# EAGLE design clocker-12b (EAGLE 7.3.0)

## Sheet 1 of 2
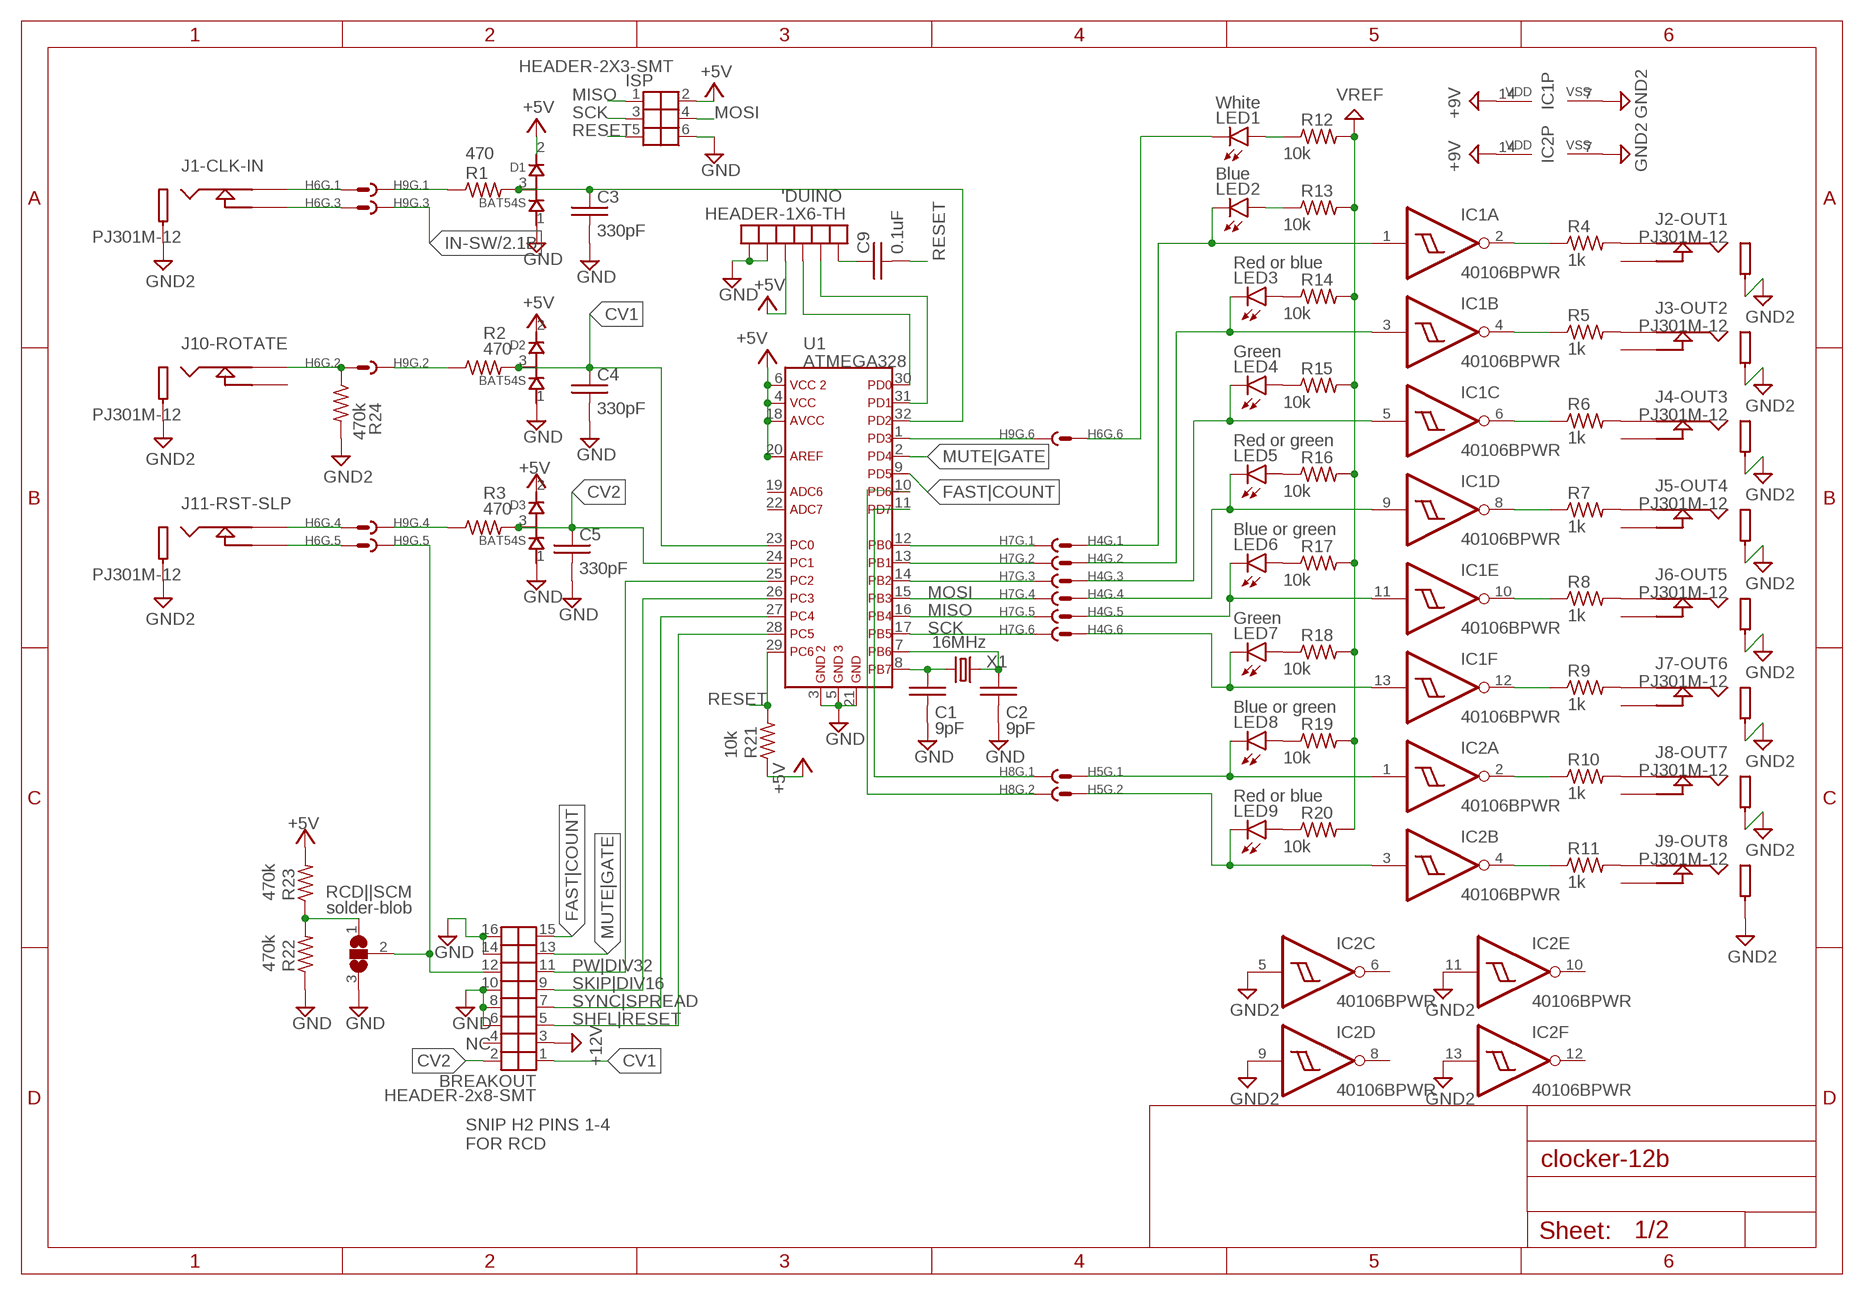
[diagram p0: schematic, sheet 1]

### Parts
'DUINO  HEADER-1X6-TH  HEADER-1X6  [HEADER-1X6-TH]
BREAKOUT  HEADER-2x8-SMT  HEADER-2X8BARE  [HEADER-2X8-SMT]
C1  9pF  CB  [C0603]
C2  9pF  CB  [C0603]
C3  330pF  CB  [C0603]
C4  330pF  CB  [C0603]
C5  330pF  CB  [C0603]
C9  0.1uF  CB  [C0603]
D1  BAT54S  DIODE-DUAL  [SOT23]
D2  BAT54S  DIODE-DUAL  [SOT23]
D3  BAT54S  DIODE-DUAL  [SOT23]
H4  HEADER-2X3-B2B-MALESMT  [HEADER-2X3-SMT]
H5  HEADER-2X3-B2B-MALESMT  [HEADER-2X3-SMT]
H6  HEADER-2X3-B2B-MALESMT  [HEADER-2X3-SMT]
H7  HEADER-2X3-B2B-FEMALETH-BOT  [HEADER-2X3-TH-BOTTOM]
H8  HEADER-2X3-B2B-FEMALETH-BOT  [HEADER-2X3-TH-BOTTOM]
H9  HEADER-2X3-B2B-FEMALETH-BOT  [HEADER-2X3-TH-BOTTOM]
IC1  40106BPWR  [TSSOP14]
IC2  40106BPWR  [TSSOP14]
ISP  HEADER-2X3-SMT  HEADER-2X3  [HEADER-2X3-SMT]
J1-CLK-IN  PJ301M-12  JACK-MONO-SWM  [PJ301M-12]
J2-OUT1  PJ301M-12  JACK-MONO-SWM  [PJ301M-12]
J3-OUT2  PJ301M-12  JACK-MONO-SWM  [PJ301M-12]
J4-OUT3  PJ301M-12  JACK-MONO-SWM  [PJ301M-12]
J5-OUT4  PJ301M-12  JACK-MONO-SWM  [PJ301M-12]
J6-OUT5  PJ301M-12  JACK-MONO-SWM  [PJ301M-12]
J7-OUT6  PJ301M-12  JACK-MONO-SWM  [PJ301M-12]
J8-OUT7  PJ301M-12  JACK-MONO-SWM  [PJ301M-12]
J9-OUT8  PJ301M-12  JACK-MONO-SWM  [PJ301M-12]
J10-ROTATE  PJ301M-12  JACK-MONO-SWM  [PJ301M-12]
J11-RST-SLP  PJ301M-12  JACK-MONO-SWM  [PJ301M-12]
LED1  White  LED  [LED-T1]
LED2  Blue  LED  [LED-T1]
LED3  Red or blue  LED  [LED-T1]
LED4  Green  LED  [LED-T1]
LED5  Red or green  LED  [LED-T1]
LED6  Blue or green  LED  [LED-T1]
LED7  Green  LED  [LED-T1]
LED8  Blue or green  LED  [LED-T1]
LED9  Red or blue  LED  [LED-T1]
R1  470  RB  [R0603]
R2  470  RB  [R0603]
R3  470  RB  [R0603]
R4  1k  RB  [R0603]
R5  1k  RB  [R0603]
R6  1k  RB  [R0603]
R7  1k  RB  [R0603]
R8  1k  RB  [R0603]
R9  1k  RB  [R0603]
R10  1k  RB  [R0603]
R11  1k  RB  [R0603]
R12  10k  RB  [R0603]
R13  10k  RB  [R0603]
R14  10k  RB  [R0603]
R15  10k  RB  [R0603]
R16  10k  RB  [R0603]
R17  10k  RB  [R0603]
R18  10k  RB  [R0603]
R19  10k  RB  [R0603]
R20  10k  RB  [R0603]
R21  10k  RB  [R0603]
R22  470k  RB  [R0603]
R23  470k  RB  [R0603]
R24  470k  RB  [R0603]
RCD||SCM  solder-blob  SJ2W  [SJ_2]
U1  ATMEGA328  ATMEGA168  [TQFP-32]
X1  16MHz  CRYSTALE  [FA-238]

### Nets
+5V: 'DUINO.P$3 D1.2(CATHODE) D2.2(CATHODE) D3.2(CATHODE) ISP.2 R21.1 R23.2 U1.4 U1.6 U1.18 U1.20 ; also sheet 2
+9V: IC1.14(P:VDD) IC2.14(P:VDD) ; also sheet 2
+12V: BREAKOUT.3 ; also sheet 2
+VREF: R12.2 R13.2 R14.2 R15.2 R16.2 R17.2 R18.2 R19.2 R20.2 ; supply symbol labelled VREF ; also sheet 2
AGND: IC1.7(P:VSS) IC2.5(C:I) IC2.7(P:VSS) IC2.9(D:I) IC2.11(E:I) IC2.13(F:I) J1-CLK-IN.2(SLEEVE) J2-OUT1.2(SLEEVE) J3-OUT2.2(SLEEVE) J4-OUT3.2(SLEEVE) J5-OUT4.2(SLEEVE) J6-OUT5.2(SLEEVE) J7-OUT6.2(SLEEVE) J8-OUT7.2(SLEEVE) J9-OUT8.2(SLEEVE) J10-ROTATE.2(SLEEVE) J11-RST-SLP.2(SLEEVE) R24.2 ; supply symbol labelled GND2 ; also sheet 2
CV1: BREAKOUT.1 C4.1 D2.3(COMMON) R2.2 U1.23
CV2: BREAKOUT.2 C5.1 D3.3(COMMON) R3.2 U1.24
CV2-SW: BREAKOUT.12 H9.P$5 RCD||SCM.2
FAST|COUNT: BREAKOUT.15 U1.9
GND: 'DUINO.P$1 'DUINO.P$2 BREAKOUT.6 BREAKOUT.8 BREAKOUT.10 BREAKOUT.14 BREAKOUT.16 C1.2 C2.2 C3.2 C4.2 C5.2 D1.1(ANODE) D2.1(ANODE) D3.1(ANODE) ISP.6 R22.1 RCD||SCM.3 U1.3 U1.5 U1.21 ; also sheet 2
IN-SW: H9.P$3 ; also sheet 2
INLED: H6.6 LED1.K(C)
MISO: H7.P$5 ISP.1 U1.16
MOSI: H7.P$4 ISP.4 U1.15
MUTE|GATE: BREAKOUT.13 U1.2
N$1: C1.1 U1.8 X1.3
N$2: C2.1 U1.7 X1.1
N$3: J2-OUT1.1(TIP) R4.2
N$4: J3-OUT2.1(TIP) R5.2
N$5: J4-OUT3.1(TIP) R6.2
N$6: J5-OUT4.1(TIP) R7.2
N$7: J6-OUT5.1(TIP) R8.2
N$8: J7-OUT6.1(TIP) R9.2
N$9: J8-OUT7.1(TIP) R10.2
N$10: J9-OUT8.1(TIP) R11.2
N$11: C3.1 D1.3(COMMON) R1.2 U1.32
N$14: LED4.A R15.1
N$15: LED5.A R16.1
N$16: H6.1 J1-CLK-IN.1(TIP)
N$17: H9.P$4 R3.1
N$18: H9.P$2 R2.1
N$20: LED1.A R12.1
N$22: LED6.A R17.1
N$23: 'DUINO.P$4 U1.30
N$24: LED2.A R13.1
N$26: LED3.A R14.1
N$29: LED7.A R18.1
N$30: LED8.A R19.1
N$31: LED9.A R20.1
N$35: R22.2 R23.1 RCD||SCM.1
N$36: H8.P$1 U1.11
N$37: H9.P$6 U1.1
N$38: H8.P$2 U1.10
N$39: H7.P$1 U1.12
N$40: 'DUINO.P$5 U1.31
N$41: 'DUINO.P$6 C9.1
N$50: H6.3 J1-CLK-IN.3(TIP-SW)
N$53: H6.2 J10-ROTATE.1(TIP) R24.1
N$54: H6.4 J11-RST-SLP.1(TIP)
N$55: IC2.4(B:O) R11.1
N$56: IC1.2(A:O) R4.1
N$57: IC1.4(B:O) R5.1
N$58: IC1.6(C:O) R6.1
N$59: IC1.8(D:O) R7.1
N$60: IC1.10(E:O) R8.1
N$61: IC1.12(F:O) R9.1
N$62: IC2.2(A:O) R10.1
N$63: H6.5 J11-RST-SLP.3(TIP-SW)
N$64: H7.P$3 U1.14
N$65: H7.P$2 U1.13
N$68: H9.P$1 R1.1
OUTLINE1: H4.1 IC1.1(A:I) LED2.K(C)
OUTLINE2: H4.2 IC1.3(B:I) LED3.K(C)
OUTLINE3: H4.3 IC1.5(C:I) LED4.K(C)
OUTLINE4: H4.4 IC1.9(D:I) LED5.K(C)
OUTLINE5: H4.5 IC1.11(E:I) LED6.K(C)
OUTLINE6: H4.6 IC1.13(F:I) LED7.K(C)
OUTLINE7: H5.1 IC2.1(A:I) LED8.K(C)
OUTLINE8: H5.2 IC2.3(B:I) LED9.K(C)
PW|DIV32: BREAKOUT.11 U1.25
RESET: C9.2 ISP.5 R21.2 U1.29
SCK: H7.P$6 ISP.3 U1.17
SHFL|RESET: BREAKOUT.5 U1.28
SKIP|DIV16: BREAKOUT.9 U1.26
SYNC|SPREAD: BREAKOUT.7 U1.27
Unconnected: BREAKOUT.4 IC2.6(C:O) IC2.8(D:O) IC2.10(E:O) IC2.12(F:O) J2-OUT1.3(TIP-SW) J3-OUT2.3(TIP-SW) J4-OUT3.3(TIP-SW) J5-OUT4.3(TIP-SW) J6-OUT5.3(TIP-SW) J7-OUT6.3(TIP-SW) J8-OUT7.3(TIP-SW) J9-OUT8.3(TIP-SW) J10-ROTATE.3(TIP-SW) U1.19 U1.22

### Notes on the sheet
- NC
- SNIP H2 PINS 1-4 
  FOR RCD

## Sheet 2 of 2
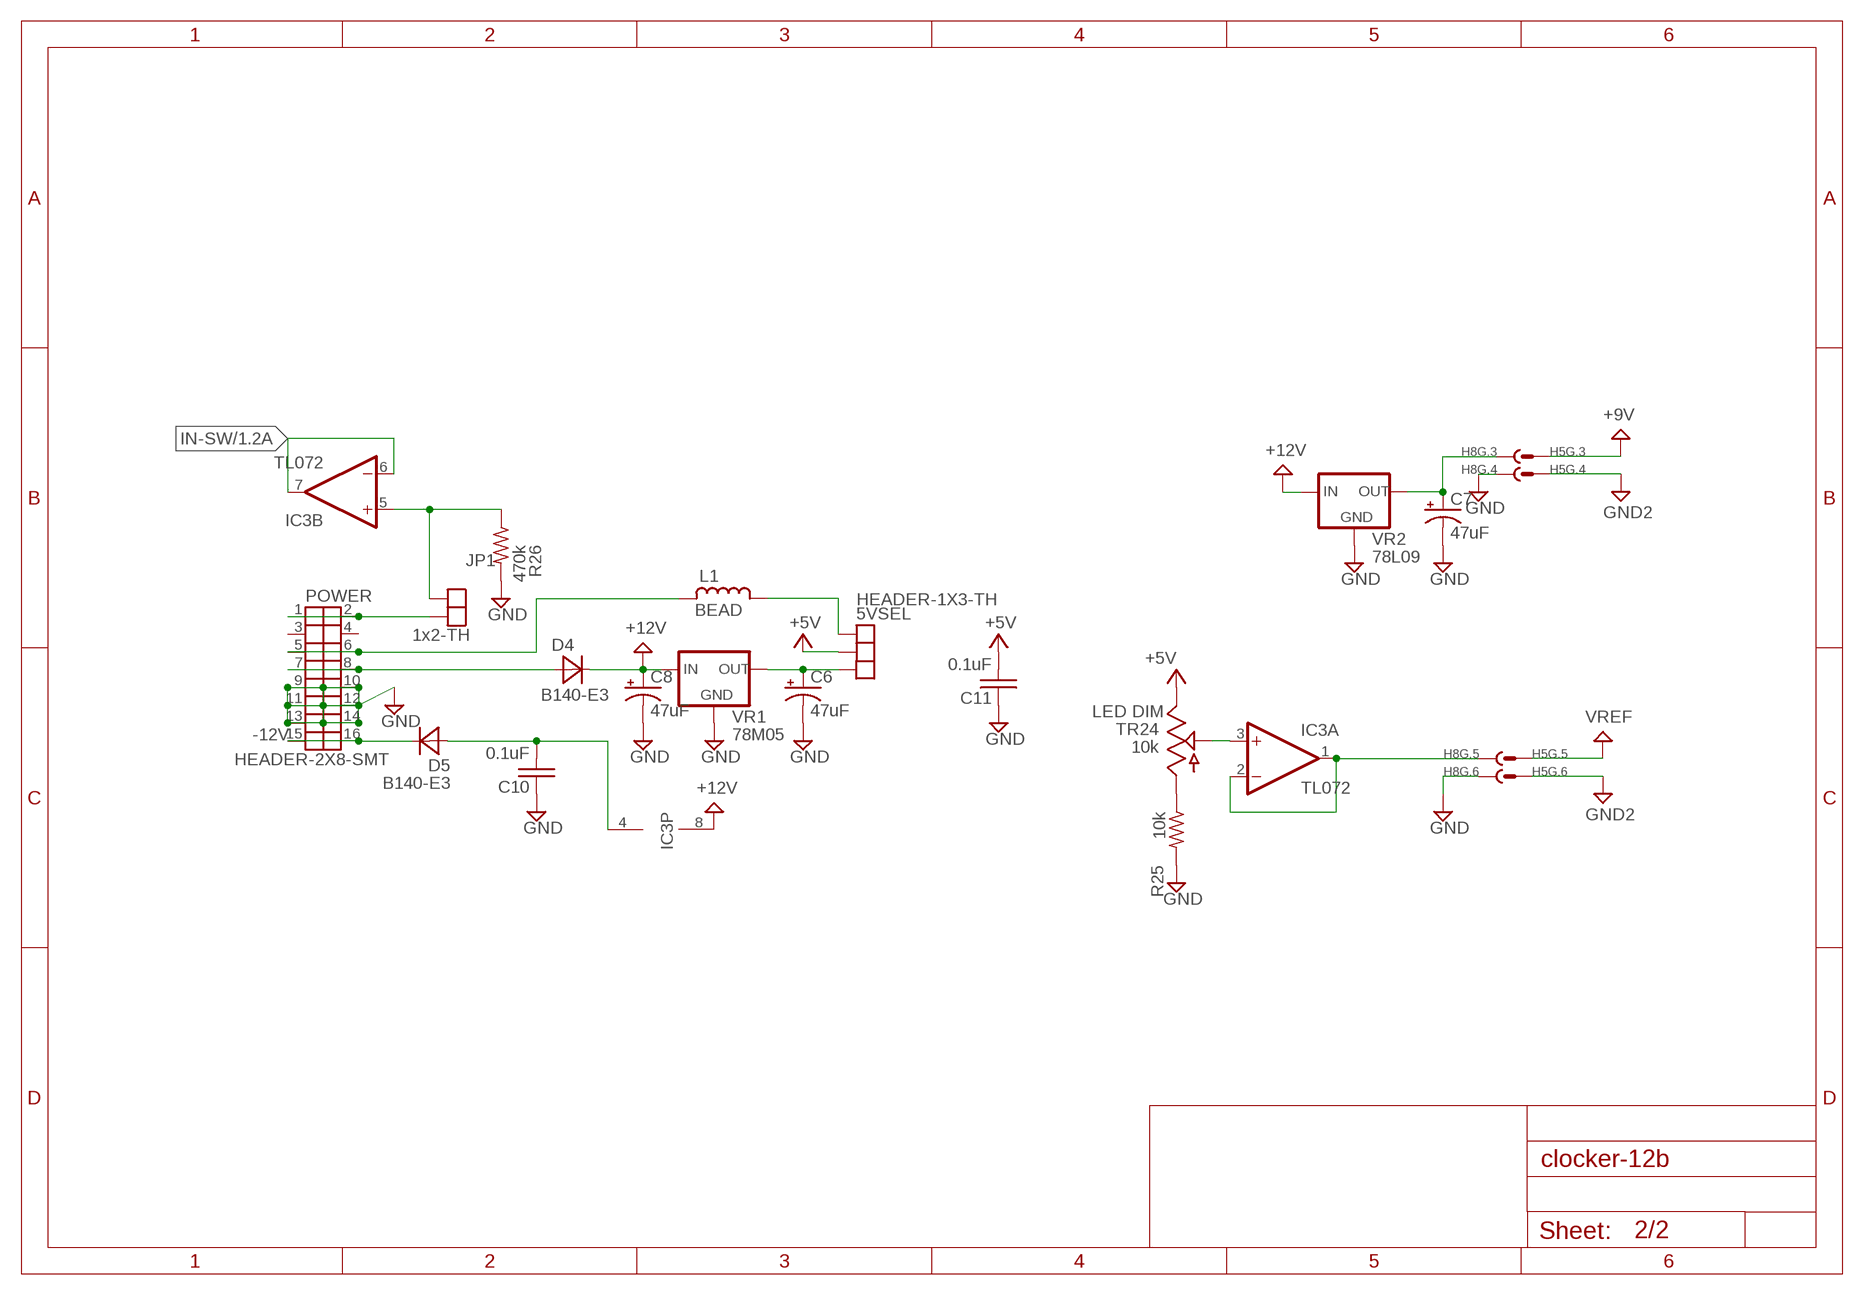
[diagram p1: schematic, sheet 2]

### Parts
5VSEL  HEADER-1X3-TH  HEADER-1X3  [HEADER-1X3-TH]
C6  47uF  C-POL5  [C-POL-5]
C7  47uF  C-POL5  [C-POL-5]
C8  47uF  C-POL5  [C-POL-5]
C10  0.1uF  CB  [C0603]
C11  0.1uF  CB  [C0603]
D4  B140-E3  DA  [SMA]
D5  B140-E3  DA  [SMA]
IC3  TL072  OPAMP-2TL072M  [SOIC8]
JP1  1x2-TH  HEADER-1X2  [HEADER-1X2-TH]
L1  BEAD  LB  [0603]
POWER  HEADER-2X8-SMT  HEADER-2X8SHRD  [HEADER-2X8-SMT-SHROUDED]
R25  10k  RB  [R0603]
R26  470k  RB  [R0603]
TR24  10k  POT-MI  [PIHER-6MM]
VR1  78M05  VREG-POS78A  [DPAK]
VR2  78L09  VREG-POS78R  [SOT89]

### Nets
+5V: 5VSEL.P$2 C11.2 TR24.3 ; also sheet 1
+9V: H5.3 ; also sheet 1
+12V: C8.+ D4.K(C) IC3.8(P:V+) VR1.1(IN) VR2.3(IN) ; also sheet 1
+VREF: H5.5 ; supply symbol labelled VREF ; also sheet 1
-12V: D5.K(C) POWER.15 POWER.16
AGND: H5.4 H5.6 ; supply symbol labelled GND2 ; also sheet 1
GND: C6.- C7.- C8.- C10.1 C11.1 H8.P$4 H8.P$6 POWER.9 POWER.10 POWER.11 POWER.12 POWER.13 POWER.14 R25.2 R26.2 VR1.4(GND) VR2.2A(GND) VR2.2B(GND) ; also sheet 1
IN-SW: IC3.6(B:-IN) IC3.7(B:OUT) ; also sheet 1
N$12: IC3.5(B:+IN) JP1.P$1 R26.1
N$25: C10.2 D5.A IC3.4(P:V-)
N$42: JP1.P$2 POWER.1 POWER.2
N$44: L1.1 POWER.5 POWER.6
N$45: D4.A POWER.7 POWER.8
N$47: C7.+ H8.P$3 VR2.1(OUT)
N$51: 5VSEL.P$3 C6.+ VR1.3(OUT)
N$52: 5VSEL.P$1 L1.2
N$67: H8.P$5 IC3.1(A:OUT) IC3.2(A:-IN)
N$70: IC3.3(A:+IN) TR24.2
N$71: R25.1 TR24.1
Unconnected: POWER.3 POWER.4

## Library data of the parts
5VSEL = 4ms-main-parts:HEADER-1X3: Male or Female Header 1x3 (35mil holes fits most square pins)
'DUINO = 4ms-main-parts:HEADER-1X6
BREAKOUT POWER = 4ms-main-parts:HEADER-2X8: SMT HEADER 2x8 Unshrouded: Cixi Langling LL1010-5C (HI TEMP 2*8PIN) Shrouded: Cixi Langling LL1007-3 (2*8PIN)
C1-C5 C9-C11 = 4ms-main-parts:C: Non-Polarized Capacitor
C6-C8 = malekko main:C-POL: Polarized Capacitor
D1-D3 = 4ms-main-parts:DIODE-DUAL: ON Semi BAT54SLT1G Max Reverse Voltage: 30V Max Power Dissipation: 225mW Max Forward Current: 200mA Vdrop at 1mA, 25°C: 320mV Vdrop at 10mA: 400mV
D4 D5 = malekko main:D: Diode
H4-H6 = 4ms-main-parts:HEADER-2X3-B2B-MALE
H7-H9 = 4ms-main-parts:HEADER-2X3-B2B-FEMALE
IC1 IC2 = 4ms-main-parts:40106: Hex SCHMITT TRIGGER
IC3 = malekko main:OPAMP-2: Dual OPAMP
ISP = 4ms-main-parts:HEADER-2X3
J1-CLK-IN J2-OUT1 J3-OUT2 J4-OUT3 J5-OUT4 J6-OUT5 J7-OUT6 J8-OUT7 J9-OUT8 J10-ROTATE J11-RST-SLP = 4ms-main-parts:JACK-MONO-SW
JP1 = 4ms-main-parts:HEADER-1X2
L1 = malekko main:L: Inductor; MOUSER: 875-MI0603K300R-10
LED1-LED9 = 4ms-main-parts:LED: LED
R1-R26 = malekko main:R: Resistor
RCD||SCM = jumper:SJ2W: SMD solder JUMPER
TR24 = malekko main:POT-M: Single Potentiometer; USE: LED DIM
U1 = 4ms-main-parts:ATMEGA168
VR1 VR2 = malekko main:VREG-POS: Positive Voltage Regulator
X1 = 4ms-main-parts:CRYSTAL: Crystal FA-238 could be Epson Timing #Q22FA2380xxxx00 (FA-238 16.0000MB or TSX-3225 16.0000MF10U-B0) Also matches footprint TSX-3225

## Board
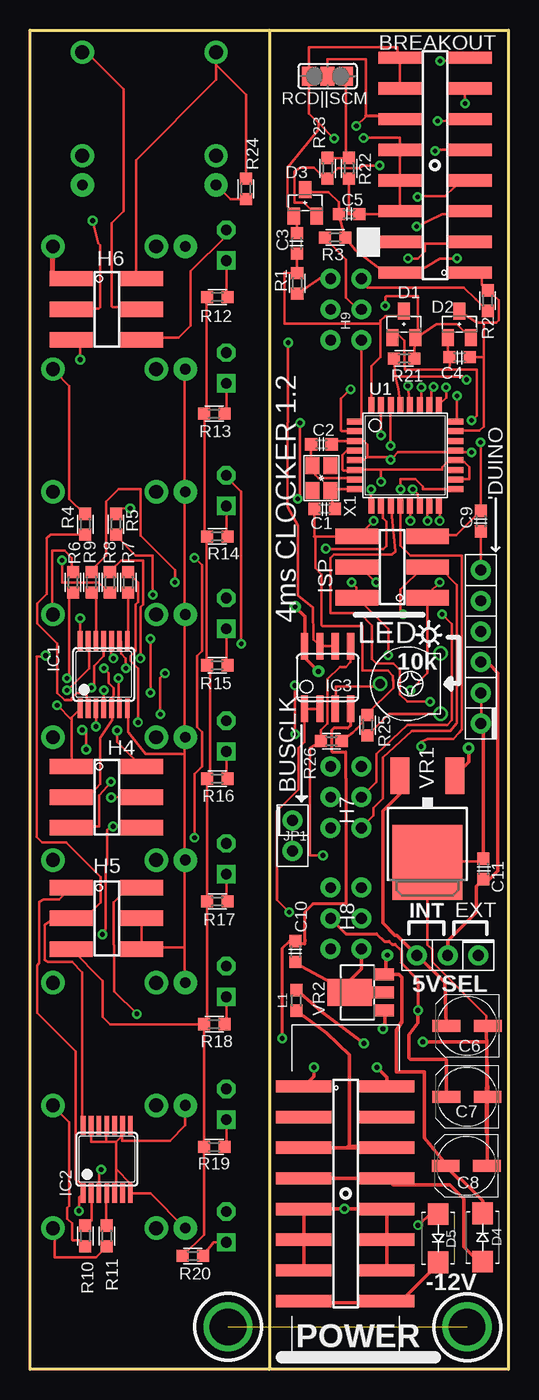
[diagram p2: board, top side]
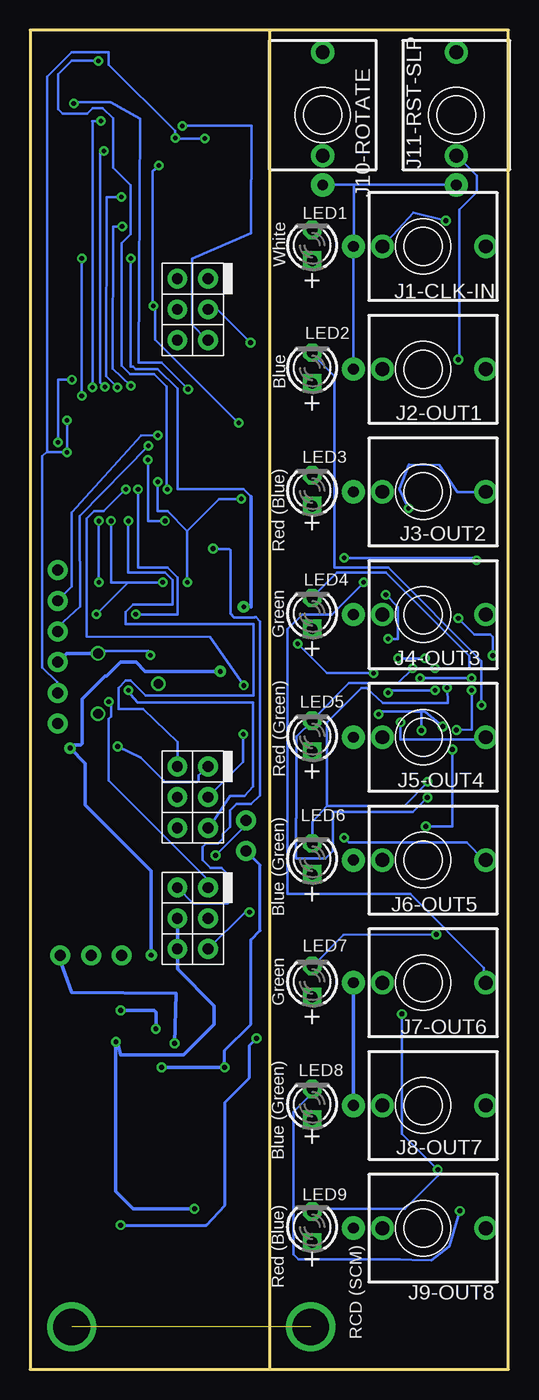
[diagram p3: board, bottom side, seen from below]

Size 39.62 x 110.87 mm. Coordinates in mm from the lower left corner, seen from the top.
Outline: 19.81,110.87 0,110.87 0,0 19.81,0
Outline: 19.81,110.87 19.81,0
Outline: 19.81,110.87 39.62,110.87 39.62,0 19.81,0
Copper layers (1*16): Top 0.035mm / dielectric 1.5mm / Bottom 0.035mm
Design rules "default *": minimum track width 8mil, minimum drill 15mil, track to track 8mil, track to pad 8mil, pad to pad 8mil, via to via 8mil, smd to smd 8mil, copper to edge 10mil, drill to drill 10mil, minimum pad ring 8mil, minimum via ring 8mil, stop-mask expansion 4mil, vias tented up to drill 16mil, thermal gap 12mil

### Footprints (pad centres in the part's own frame; a part is rotated, then mirrored left to right if it is on the bottom)
HEADER-1X3-TH = drill 0.9 pad 1.651: P$1 0,2.54; P$2 0,0; P$3 0,-2.54
HEADER-1X6-TH = drill 0.9 pad 1.651: P$1 1.27,6.35; P$2 1.27,3.81; P$3 1.27,1.27; P$4 1.27,-1.27 | drill 0.889 pad 1.651: P$5 1.27,-3.81; P$6 1.27,-6.35
HEADER-2X8-SMT = smd 1.016 x 3.556: 1 -8.89,-2.95; 2 -8.89,2.899; 3 -6.35,-2.95; 4 -6.35,2.899; 5 -3.81,-2.95; 6 -3.81,2.899; 7 -1.27,-2.95; 8 -1.27,2.899; 9 1.27,-2.95; 10 1.27,2.899; 11 3.81,-2.95; 12 3.81,2.899; 13 6.35,-2.95; 14 6.35,2.899; 15 8.89,-2.95; 16 8.89,2.899
C0603 = smd 1 x 1: 1 -0.85,0; 2 0.85,0
C-POL-5 = smd 2.3 x 1: + 1.725,0; - -1.7,0
SOT23 = smd 1 x 1.4: 1 -0.95,-1.1; 2 0.95,-1.1; 3 0,1.1
SMA = smd 1.8 x 1.7: A -2,0; K 2,0
HEADER-2X3-SMT = smd 1.27 x 3.556: 1 -2.54,-2.95; 2 -2.54,2.899; 3 0,-2.95; 4 0,2.899; 5 2.54,-2.95; 6 2.54,2.899
HEADER-2X3-TH-BOTTOM = drill 0.9 pad 1.651: P$1 -1.27,2.54; P$2 1.27,2.54; P$3 -1.27,0; P$4 1.27,0; P$5 -1.27,-2.54; P$6 1.27,-2.54
TSSOP14 = smd 0.4 x 1.6: 1 -1.95,-2.8; 2 -1.3,-2.8; 3 -0.65,-2.8; 4 0,-2.8; 5 0.65,-2.8; 6 1.3,-2.8; 7 1.95,-2.8; 8 1.95,2.8; 9 1.3,2.8; 10 0.65,2.8; 11 0,2.8; 12 -0.65,2.8; 13 -1.3,2.8; 14 -1.95,2.8
SOIC8 = smd 0.6 x 2.2: 1 -1.905,-2.6; 2 -0.635,-2.6; 3 0.635,-2.6; 4 1.905,-2.6; 5 1.905,2.6; 6 0.635,2.6; 7 -0.635,2.6; 8 -1.905,2.6
PJ301M-12 = drill 1.143 pad 1.93: 1 -4.369,0; 3 4.191,0 | drill 0.889 pad 1.93: 2 6.604,0
HEADER-1X2-TH = drill 0.9 pad 1.651: P$1 0,2.54; P$2 0,0
0603 = smd 1 x 1: 1 -0.85,0; 2 0.85,0
LED-T1 = drill 0.889 pad 1.524 square: A -1.27,0 | drill 0.889 pad 1.524 octagon: K 1.27,0
HEADER-2X8-SMT-SHROUDED = smd 1.016 x 4.572: 1 -8.89,-3.458; 2 -8.89,3.407; 3 -6.35,-3.458; 4 -6.35,3.407; 5 -3.81,-3.458; 6 -3.81,3.407; 7 -1.27,-3.458; 8 -1.27,3.407; 9 1.27,-3.458; 10 1.27,3.407; 11 3.81,-3.458; 12 3.81,3.407; 13 6.35,-3.458; 14 6.35,3.407; 15 8.89,-3.458; 16 8.89,3.407
R0603 = smd 1 x 1: 1 -0.85,0; 2 0.85,0
SJ_2 = smd 1.168 x 1.6: 1 -1.524,0; 2 0,0; 3 1.524,0
PIHER-6MM = drill 0.8: 1 -2.5,-2.5; 2 0,2.5; 3 2.5,-2.5
TQFP-32 = smd 1.25 x 0.5: 1 -4.2,2.8; 2 -4.2,2; 3 -4.2,1.2; 4 -4.2,0.4; 5 -4.2,-0.4; 6 -4.2,-1.2; 7 -4.2,-2; 8 -4.2,-2.8; 17 4.2,-2.8; 18 4.2,-2; 19 4.2,-1.2; 20 4.2,-0.4; 21 4.2,0.4; 22 4.2,1.2; 23 4.2,2; 24 4.2,2.8 | smd 0.5 x 1.25: 9 -2.8,-4.2; 10 -2,-4.2; 11 -1.2,-4.2; 12 -0.4,-4.2; 13 0.4,-4.2; 14 1.2,-4.2; 15 2,-4.2; 16 2.8,-4.2; 25 2.8,4.2; 26 2,4.2; 27 1.2,4.2; 28 0.4,4.2; 29 -0.4,4.2; 30 -1.2,4.2; 31 -2,4.2; 32 -2.8,4.2
DPAK = smd 1.6 x 3: 1 -2.28,-4.8; 3 2.28,-4.8 | smd 5.8 x 6.2: 4 0,2.38
SOT89 = smd 1 x 1.5: 1 -1.5,-2; 3 1.5,-2 | smd 1 x 1.8: 2A 0,-1.85 | smd 2.2 x 3.7: 2B 0,0.9
FA-238 = smd 1.4 x 1.15: 1 -1.05,-0.75; 2 1.05,-0.75; 3 1.05,0.75; 4 -1.05,0.75

### Placement (x,y rotation side)
5VSEL  34.58,34.28 270 top
'DUINO  38.61,59.82 180 top
BREAKOUT  33.53,99.69 90 top
C1  24.38,71.25 180 top
C2  24.13,76.58 0 top
C3  22.1,93.22 90 top
C4  35.57,83.79 180 top
C5  26.42,95.63 0 top
C6  36.21,28.44 180 top
C7  36.2,22.57 180 top
C8  36.13,16.84 180 top
C9  37.34,70.23 90 top
C10  21.98,34.59 90 top
C11  37.54,41.43 270 top
D1  30.96,86.53 0 top
D2  35.56,86.53 0 top
D3  22.78,96.58 0 top
D4  37.49,10.92 90 top
D5  33.79,10.86 270 top
H4  6.35,47.37 270 top
H5  6.35,37.34 270 top
H6  6.35,87.76 270 top
H7  26.16,47.37 0 top
H8  26.16,37.34 0 top
H9  26.16,87.76 0 top
IC1  6.1,57.53 0 top
IC2  6.35,17.4 0 top
IC3  24.64,57.28 0 top
ISP  29.97,66.42 90 top
J1-CLK-IN  6.25,92.96 180 bottom
J2-OUT1  6.25,82.8 180 bottom
J3-OUT2  6.25,72.64 180 bottom
J4-OUT3  6.25,62.48 180 bottom
J5-OUT4  6.25,52.32 180 bottom
J6-OUT5  6.25,42.16 180 bottom
J7-OUT6  6.25,32 180 bottom
J8-OUT7  6.25,21.84 180 bottom
J9-OUT8  6.25,11.68 180 bottom
J10-ROTATE  15.39,104.67 270 bottom
J11-RST-SLP  4.32,104.67 270 bottom
JP1  21.73,42.91 0 top
L1  22.05,30.54 90 top
LED1  16.26,93.07 90 bottom
LED2  16.26,82.91 90 bottom
LED3  16.26,72.75 90 bottom
LED4  16.26,62.59 90 bottom
LED5  16.26,52.43 90 bottom
LED6  16.26,42.27 90 bottom
LED7  16.26,32.11 90 bottom
LED8  16.26,21.95 90 bottom
LED9  16.26,11.79 90 bottom
POWER  26.12,14.54 270 top
R1  22.12,89.92 90 top
R2  37.9,88.48 90 top
R3  25.27,93.7 0 top
R4  4.57,69.98 90 top
R5  7.11,69.98 90 top
R6  3.56,65.15 90 top
R7  8.13,65.15 90 top
R8  6.6,65.15 270 top
R9  5.08,65.15 90 top
R10  4.57,11.05 270 top
R11  6.35,11.05 270 top
R12  15.49,88.77 180 top
R13  15.24,79.12 180 top
R14  15.49,68.96 180 top
R15  15.49,58.29 180 top
R16  15.49,48.9 180 top
R17  15.49,38.73 180 top
R18  15.24,28.57 180 top
R19  15.24,18.41 180 top
R20  13.49,9.39 180 top
R21  30.98,83.69 180 top
R22  26.42,99.44 90 top
R23  24.64,99.44 270 top
R24  17.87,97.73 270 top
R25  27.95,53.34 90 top
R26  24.96,52.01 0 top
RCD||SCM  24.64,107.06 180 top
TR24  31.5,56.77 90 top
U1  31.06,75.67 0 top
VR1  32.91,44.34 180 top
VR2  27.37,31.2 90 top
X1  24.13,73.79 270 top

### Tracks (layer width: path | path; a pad name or v marks a point on that pad's centre or on a via)
+5V  (via drill 0.38)
  Top 0.203: U1.4 26.26,76.07 25.88,75.69 25.88,74.47 25.93,74.42 26.82,74.42 U1.6 27.03,74.5 29.06,74.5 | 24.64,98.25 R23.2 | 31.99,84.02 R21.1 31.86,85.64 D1.2 | 28.91,99.44 28.91,99.47 v28.96,99.67 27.51,99.67 27.28,99.44 25.49,99.44 R23.2 | U1.18 35.36,73.69 36.37,73.69 36.37,74.7 35.97,75.11 35.36,75.11 U1.20 35.15,75.11 34.54,75.11 34.14,74.7 34.14,74.5 29.06,74.5 | v29.67,59.13 29.67,61.29 27.23,63.73 ISP.2 27.03,63.93 27.03,64.75 v26.62,65.15 | v29.06,73.48 29.06,74.5 | v22.15,72.06 22.35,72.26 v22.35,78.36 | D2.2 35.33,86.53 33.64,86.53 32.47,85.69 D1.2 | D3.2 22.71,96.58 21.91,96.58 21.91,99.17 22.36,99.48 23.51,99.48 24.4,98.59 R23.2 | D1.2 32.12,85.9 32.12,88.85 29.5,88.85 29.41,88.76 v29.41,88.04
  Top 0.305: 5VSEL.P$2 34.58,35.47 36.96,37.85 36.96,39.99 C11.2 38.04,40.58 38.73,41.27 38.73,57.66 37.97,58.42 37.47,58.42 'DUINO.P$3
  Bottom 0.203: 28.91,99.47 v28.96,99.67 29.46,99.19 29.46,88.09 v29.41,88.04 29.26,87.91 29.26,85.27 v22.35,78.36 | v29.67,59.13 29.87,59.46 33.93,59.46 TR24.3 | v29.06,73.48 29.06,71.04 28.25,71.04 26.62,69.42 | v26.62,65.15 26.62,69.42 | 26.62,69.42 23.98,72.06 v22.15,72.06
  Bottom 0.305: 'DUINO.P$3 36.62,59.27 TR24.3
+9V  (via drill 0.41)
  Top 0.203: IC2.14 4.3,20.29 4.3,32.88 3.47,33.72 1.45,33.72 1.22,33.91 1.22,36.8 1.98,37.34 H5.3 4.5,37.34 5.83,38.67 5.83,40.77 2.97,43.62 0.99,43.62 0.53,44.08 0.53,59.02 1.22,59.02 v1.29,59.09 | IC1.14 v4.15,62.18
  Bottom 0.203: v4.15,62.18 2.82,60.85 1.52,60.85 1.29,60.62 v1.29,59.09
+12V  (via drill 0.38, 0.38 pad 0.97, 0.41 pad 0.97)
  Top 0.203: v31.29,91.97 32.11,91.97 32.72,92.58 32.72,93.19 36.37,93.19 BREAKOUT.3 | 22.76,60.07 IC3.8
  Top 0.305: v21.95,63.12 22.76,62.31 22.76,60.07 | D4.K 37.49,13.95 35.66,15.77 35.47,15.77 C8.+ 34.41,17.07 32.65,19.16 32.65,24.62 30.35,24.64 30.35,28.08 30.8,28.78 30.8,32.46 30.55,32.7 29.53,32.7 | VR2.3 29.53,32.7 | 29.53,32.7 29.46,32.77 29.46,34.16 v29.59,34.29 | v36.32,51.44 36.32,50.27 VR1.1 | IC3.8 22.73,58.93 v23.88,57.78
  Bottom 0.203: v31.29,91.97 31.29,83.03 31.09,83.03 30.89,82.83 29.06,82.83 27.43,81.2 27.43,72.87 21.95,72.87 21.34,72.26 | v21.95,63.12 21.34,63.12
  Bottom 0.305: 21.34,63.12 21.34,72.26 | v29.59,34.29 29.59,41.27 35.05,46.74 35.05,50.16 v36.32,51.44 36.07,51.69 35.43,51.69 35.31,51.82 35.31,55.5 33.4,57.4 33.27,57.4 32.13,58.55 30.86,58.55 30.1,57.78 v23.88,57.78
+VREF
  Top 0.203: R12.2 14.63,88.72 14.63,79.38 14.43,79.17 R13.2 14.43,78.97 14.43,69.22 14.63,69.01 R14.2 14.63,68.81 14.63,58.45 R15.2 14.64,57.98 14.9,57.72 14.9,49.15 R16.2 R17.2 14.64,28.83 R18.2 | R20.2 14.39,11.14 R19.2 R18.2 | H5.5 6.02,32.18 6.02,29.18 6.63,28.57 R18.2
-12V
  Top 0.305: POWER.15 22.79,5.52 30.14,5.52 | 30.14,5.52 30.59,5.52 33.8,8.72 D5.K | POWER.16 30.01,5.65 30.14,5.52
AGND
  Top 0.203: 7.11,18.82 7.11,16.59 | 7.11,16.59 7.11,14.76 IC2.5 | 7.11,18.82 7.52,19.23 7.52,20.04 IC2.9 7.62,20.17 7.62,18.94 11.58,18.94 12.85,20.21 J8-OUT7.2 | 7.11,16.59 8.33,15.37 8.33,14.76 IC2.7 8.33,14.55 9.96,14.55 12.8,11.71 J9-OUT8.2 | 6.3,18.82 7.11,18.82 | 6.3,18.82 6.3,20.04 IC2.11 | 12.8,50.97 9.58,50.97 8.13,52.76 8.13,54.59 IC1.7 | 12.8,50.97 12.8,52.15 J5-OUT4.2 12.8,52.35 12.8,62.31 J4-OUT3.2 12.8,62.51 12.8,72.47 J3-OUT2.2 12.8,72.67 12.8,82.63 J2-OUT1.2 | 12.8,34.94 12.8,41.99 J6-OUT5.2 12.8,42.19 12.8,50.97 | 12.8,34.94 12.8,32.03 | 12.8,32.03 J7-OUT6.2 | R24.2 16.59,96.88 J10-ROTATE.2 | H5.4 H5.6 9.39,34.94 12.8,34.94 | 12.8,32.03 12.84,32.07 12.84,32.16 | IC2.13 5.07,20.18 5.07,18.82 6.3,18.82
  Bottom 0.203: J10-ROTATE.2 12.8,98.07 | 12.8,98.07 J11-RST-SLP.2 | 12.8,98.07 12.8,92.99 J1-CLK-IN.2 J2-OUT1.2
  Bottom 0.305: J7-OUT6.2 J8-OUT7.2
CV1
  Top 0.203: 37.41,90.75 37.41,90.93 | 37.41,90.75 36.58,90.75 BREAKOUT.1 | 37.41,90.75 37.41,89.81 R2.2 38.82,88.52 38.82,86.87 38.59,86.64 37.57,86.64 | D2.3 36.39,87.06 36.35,87.1 36.99,86.64 37.57,86.64 | 37.57,86.64 37.57,84.35 | 37.57,84.35 37.58,83.8 C4.1 | U1.23 35.32,77.72 37.22,77.72 37.57,78.07 37.57,84.35
CV2  (via drill 0.38)
  Top 0.203: v35.36,80.59 35.36,78.56 U1.24 | D3.3 23.27,97.46 24.73,97.46 25.57,96.62 C5.1 25.4,95.63 25.57,95.47 R3.2 26.29,93.5 26.94,92.66 29.22,90.91 30.06,90.91 30.16,90.81 BREAKOUT.2 32.03,90.81 32.04,90.79 33.95,91.94 v35.36,91.97
  Bottom 0.203: v35.36,91.97 v35.36,80.59
CV2-SW  (via drill 0.38)
  Top 0.203: RCD||SCM.2 24.64,108.46 27.81,108.46 27.81,103.76 27.84,103.76 | 27.84,103.76 29.26,103.76 | 29.26,103.76 29.34,103.76 | 29.34,103.76 29.34,103.63 | 29.34,103.76 29.34,103.78 29.26,103.78 | 29.26,103.78 27.84,103.78 | 27.84,103.78 27.79,103.78 | 27.84,103.76 v27.03,102.95 | 27.84,103.76 27.84,103.78 | 29.26,103.76 29.26,103.56 30.48,103.56 BREAKOUT.12 | 29.26,103.76 29.26,103.78
  Bottom 0.203: v27.03,102.95 21.3,102.95 21.34,94.07 26.21,91.97 26.21,86.49 24.99,85.27 H9.P$5
FAST|COUNT  (via drill 0.38)
  Top 0.203: BREAKOUT.15 36.22,108.33 v33.96,108.33 | U1.9 28.25,71.49 v28.25,72.85
  Bottom 0.203: v28.25,72.85 28.32,72.92 28.32,81.38 29.34,82.4 31.34,82.4 32.05,83.11 32.05,93.22 31.29,93.98 31.29,98.02 32.77,99.49 32.77,103.58 33.6,104.42 34.44,104.42 34.9,103.96 36.93,103.96 37.29,104.32 37.29,107.24 36.2,108.33 v33.96,108.33
GND  (via drill 0.38, 0.41)
  Top 0.203: C2.2 24.98,76.87 U1.3 27.65,76.87 27.94,76.58 27.94,75.56 27.86,75.49 | U1.5 26.91,75.31 27.69,75.31 27.86,75.49 | D3.1 22.1,96.06 22.1,95.48 | 22.1,95.48 C3.2 | R22.1 26.42,95.63 C5.2 29.08,95.63 29.08,95.83 | 29.08,95.83 29.08,95.89 | 23.62,68.94 ISP.6 27.23,69.01 v28.45,70.23 | 23.62,68.94 23.52,68.94 23.53,68.96 C1.2 | D2.1 34.61,84.25 C4.2 34.76,83.35 34.71,82.77 | BREAKOUT.14 BREAKOUT.16 30.43,108.58 30.43,109.45 23.11,109.45 RCD||SCM.3 23.11,103.96 23.88,103.2 | v27.61,101.96 30.63,101.96 BREAKOUT.10 BREAKOUT.8 BREAKOUT.6 30.48,95.83 29.08,95.83 | v25.17,101.91 23.88,103.2 | 34.71,82.77 31.03,82.77 31.01,83.46 31.01,85.15 30.48,85.69 D1.1 | 29.06,95.83 29.08,95.83 | 29.87,75.51 27.84,75.51 27.86,75.49 | 29.87,75.51 30.07,75.51 30.48,75.92 35.15,75.92 U1.21 35.36,75.92 v36.58,75.92 | v36.58,78.56 36.98,78.97 36.98,82.78 34.75,82.78 34.71,82.77 | 'DUINO.P$1 37.39,53.57 37.39,56.01 'DUINO.P$2 | v29.87,75.31 29.87,75.51 | 22.1,95.48 21.3,96.32 21.3,99.48 23.88,102.63 23.88,103.2 | R26.2 26.75,52.73 27,52.96 27.08,53.06 27.56,53.59 27.56,54.05 R25.2 27.95,54.29 30.07,56.41 30.07,57.02 30.06,57.04 30.06,57.42 29.64,57.84 27.51,57.84 27.51,61.53 24.23,61.53 24.13,61.63 24.13,65.81 23.62,66.32 23.62,68.94 | C11.1 37.39,42.27 37.19,42.06 32.92,42.06 VR1.4 32.92,41.86 32.92,35.15 33.33,34.75 33.33,33.73 37.8,29.26 37.8,28.45 C6.-
  Top 0.254: C10.1 21.98,33.66 VR2.2B
  Top 0.305: v32.52,27.1 37.83,27.1 | 37.83,27.1 37.87,19.62 37.87,16.88 C8.- | 37.83,27.1 37.77,19.63 C7.- 37.77,28.3 C6.- | POWER.13 POWER.11 POWER.9 26,13.27 v26.02,13.3 26.05,13.27 POWER.10 POWER.12 POWER.14 | VR2.2A VR2.2B 26.47,32.18 27.43,33.15 H8.P$6 | 'DUINO.P$1 37.54,53.26 C11.1 37.54,43.48
  Bottom 0.203: v25.17,101.91 27.61,101.91 v27.61,101.96 27.64,102.13 27.64,102.54 33.12,108.03 33.12,109.04 36.17,109.04 38.2,107.01 38.2,76 | v36.58,78.56 v36.58,75.92 38.2,75.92 38.2,76 | v29.87,75.31 29.87,70.23 v28.45,70.23 | 38.2,76 38.61,75.59 38.61,58.12 37.39,56.9 37.39,56.08 'DUINO.P$2
  Bottom 0.305: v26.02,13.3 26.75,13.3 26.76,13.28 31.09,13.28 32.52,14.72 v32.52,27.1 32.4,27.04 32.13,26.04 26.92,26.04 24.38,28.57 24.38,30.1 27.43,33.15 H8.P$6 H8.P$4
IN-SW  (via drill 0.41)
  Top 0.203: IC3.7 IC3.6 25.26,59.89 24,59.89 23.47,60.43 23.44,63.06 22.2,64.07 22.17,69.88 21.3,71.44 21.3,78.33 21.37,78.41 v21.37,85
  Bottom 0.203: v21.37,85 24.13,87.76 H9.P$3
INLED
  Top 0.203: H6.6 9.45,85.42 12.31,85.42 13.3,86.41 13.3,90.91 16.26,93.87 LED1.K
MISO  (via drill 0.38)
  Top 0.203: v33.93,70.23 33.93,71.45 U1.16 | v33.93,65.15 33.12,64.34 33.12,63.93 ISP.1 32.92,63.73 32.92,57.63 v31.5,56.21
  Bottom 0.203: v33.93,65.15 v33.93,70.23 | v31.5,56.21 31.6,56.21 30.71,55.19 21.16,55.19 21.18,48.25 21.88,47.47 23.05,47.46 24.79,44.83 H7.P$5
MOSI  (via drill 0.38)
  Top 0.203: v32.92,70.23 32.92,71.45 U1.15 | v28.65,65.15 27.23,66.57 ISP.4 | v34.14,62.51 34.95,61.7 34.95,53.75 34.54,53.34 31.24,53.34 28.7,50.93 28.7,48.64 H7.P$4
  Bottom 0.203: v32.92,70.23 32.92,65.15 31.5,65.15 | v28.65,65.15 31.5,65.15 | 31.5,65.15 v34.14,62.51
MUTE|GATE  (via drill 0.38)
  Top 0.203: BREAKOUT.13 36.02,105.58 v36.02,104.8 | v26.54,81.15 25.76,80.37 25.76,77.72 25.81,77.67 U1.2
  Bottom 0.203: v36.02,104.8 35.97,104.9 32.94,104.9 30.53,103.53 30.63,83.34 28.75,83.34 v26.54,81.15
N$1
  Top 0.203: U1.8 25.13,72.87 X1.3 25.13,71.25 C1.1
N$2
  Top 0.203: U1.7 26.74,73.79 23.88,73.79 23.62,74.04 23.62,74.3 23.57,74.3 23.57,74.7 X1.1 23.28,75.19 C2.1
N$3
  Top 0.203: R4.2 4.47,70.84 3.25,72.06 3.25,81.41 2.03,82.63 J2-OUT1.1
N$4  (via drill 0.38)
  Top 0.203: v8.28,71.3 7.52,71.25 R5.2
  Bottom 0.203: v8.28,71.3 9.05,72.89 8.24,74.91 5.71,74.87 4.23,72.64 J3-OUT2.1
N$5
  Top 0.203: R6.2 3.45,66.17 3.45,67.18 2.85,67.79 1.83,67.79 1.83,62.51 J4-OUT3.1
N$6  (via drill 0.38)
  Top 0.203: v8.94,53.56 8.94,58.04 8.33,58.65 8.33,59.05 8.74,59.46 8.74,63.32 8.94,63.52 8.94,65.15 8.13,65.96 R7.2
  Bottom 0.203: v8.94,53.56 8.94,52.15 2.03,52.15 J5-OUT4.1
N$7  (via drill 0.38)
  Top 0.203: v2.64,66.98 2.64,65.15 5.69,65.15 6.5,64.34 R8.2 | v13.61,67.18 14.22,66.57 14.22,59.46 13.82,59.05 13.82,53.16 14.22,52.76 14.22,49.91 13.61,49.3 v13.61,44.02
  Bottom 0.203: v2.64,66.98 2.85,67.18 v13.61,67.18 | v13.61,44.02 13.21,43.61 3.45,43.61 2.03,42.19 J6-OUT5.1
N$8  (via drill 0.38)
  Top 0.203: v11.99,65.15 11.99,66.17 9.14,69.01 9.14,72.87 7.32,72.87 6.3,71.86 6.3,67.39 5.08,66.17 R9.2
  Bottom 0.203: v11.99,65.15 14.63,62.51 17.07,62.51 18.29,61.29 18.29,39.34 8.13,39.34 2.03,33.25 2.03,32.03 J7-OUT6.1
N$9
  Top 0.203: R10.2 4.47,10.29 4.09,10.67 3.5,10.67 3.47,10.71 3.47,12.08 3.09,12.46 3.09,13.37 3.25,13.54 3.25,20.45 2.03,21.67 J8-OUT7.1
N$10
  Top 0.203: R11.2 6.3,10.08 5.49,9.27 2.03,9.27 2.03,11.51 J9-OUT8.1
N$11
  Top 0.203: 29.03,86.59 29.03,86.82 29.43,87.21 30.75,87.21 30.96,87.43 D1.3 | U1.32 28.26,83.06 29.03,83.82 29.03,86.59 | 29.03,86.59 21.06,86.59 21.06,90.78 R1.2 22.1,90.79 C3.1
N$12  (via drill 0.41)
  Top 0.203: IC3.5 26.54,58.55 26.16,58.17 25.65,58.17 24.64,57.15 24.64,53.47 24.11,52.93 R26.1 23.16,51.45 23.16,42.55 v24.26,42.55
  Bottom 0.203: v24.26,42.55 21.73,45.07 JP1.P$1
N$14
  Top 0.203: LED4.A 16.26,58.45 R15.1
N$15
  Top 0.203: LED5.A 16.26,48.9 R16.1
N$16
  Top 0.406: H6.1 1.88,90.3 J1-CLK-IN.1
  Bottom 0.203: 2.03,92.79 J1-CLK-IN.1
N$17
  Top 0.203: R3.1 26.18,91.87 26.18,88.73 27.15,87.76 H9.P$4
N$18
  Top 0.203: R2.1 36.92,88.61 35.93,89.57 27.93,89.57 H9.P$2
N$20
  Top 0.203: LED1.A 16.26,88.92 R12.1
N$21  (via drill 3.05)  (1 unrouted)
  other vias: 16.38,3.51 36.2,3.51
N$22
  Top 0.203: LED6.A 16.26,38.73 R17.1
N$23  (via drill 0.38)
  Top 0.203: U1.30 29.84,79.76 v29.84,76.45
  Bottom 0.203: v29.84,76.45 35.51,70.64 35.48,63.17 37.77,61.09 'DUINO.P$4
N$24
  Top 0.203: LED2.A 16.26,79.17 R13.1
N$25  (via drill 0.41)
  Top 0.254: IC3.4 26.54,53.29 26.33,53.1 26.31,53.09 25.15,53.09 24.97,52.91 24.97,51.18 25.02,51.13 26.14,51.13 26.14,48.92 26.16,48.9 26.16,38.56 26.14,38.53 23.42,38.53 22.73,37.85 22.73,35.2 | 22.77,35.59 22.73,35.2 | 22.73,35.2 21.93,35.2 C10.2 21.46,35.45 20.88,34.86 v20.88,27.39 | D5.A 33.26,13.39 33.26,12.94 v32.13,11.94
  Bottom 0.254: v32.13,11.94 25.02,11.94 23.5,13.59 23.5,22.1 21.46,24.13 21.46,26.81 v20.88,27.39
N$26
  Top 0.203: LED3.A 16.26,69.01 R14.1
N$29
  Top 0.203: LED7.A 16.26,28.57 R18.1
N$30
  Top 0.203: LED8.A 16.26,18.41 R19.1
N$31
  Top 0.203: LED9.A 15.19,10.52 R20.1
N$35
  Top 0.203: R23.1 R22.2 26.16,100.55 RCD||SCM.1
N$36  (via drill 0.38)
  Top 0.203: U1.11 30.25,67.71 29.97,67.44 25.15,67.44 24.89,67.18 24.89,62.61 27.3,62.61 28.32,61.59 28.32,58.8 28.7,58.42 30.1,58.42 30.61,57.91 30.61,55.88 31.24,55.27 v33.12,55.27
  Bottom 0.203: v33.12,55.27 32.92,55.07 32.92,54.05 33.12,53.85 33.12,48.77 24.99,40.64 24.99,40.03 H8.P$1
N$37
  Top 0.203: U1.1 27.43,78.47 H9.P$6
N$38  (via drill 0.41)
  Top 0.203: U1.10 29.06,71.14 29.23,70.97 29.23,70.46 29.49,70.21 29.49,68.15 29.26,67.92 24.77,67.92 24.74,67.94 v24.49,67.94
  Bottom 0.203: v24.49,67.94 24.46,67.92 23.16,67.92 23.04,67.84 23.04,62.56 22.73,62.26 21.03,62.26 21.01,62.28 20.93,62.28 20.57,61.92 20.57,55.75 20.6,55.73 20.6,47.5 21.31,46.79 22.17,46.79 22.2,46.81 22.53,46.81 23.06,46.28 23.06,44.91 23.65,44.32 23.65,43.97 24.08,43.54 25.07,43.54 25.35,43.26 25.35,42.16 24.69,41.5 23.77,41.5 23.24,40.97 23.24,38.61 23.29,38.56 26.11,38.56 H8.P$2
N$39  (via drill 0.41)
  Top 0.203: U1.12 30.68,71.45 30.68,68.2 31.5,67.39 35.76,67.39 35.76,52.96 35.56,52.7 35.05,52.2 32.89,52.2 32.38,51.94 v32.38,51.56
  Bottom 0.203: v32.38,51.56 30.48,50.67 28.57,48.77 28.57,48.64 25.78,48.64 25.65,48.77 25.65,49.15 H7.P$1
N$40  (via drill 0.38)
  Top 0.203: v29.06,77.33 29.06,78.92 U1.31
  Bottom 0.203: 'DUINO.P$5 36.17,64.8 36.17,70.92 30.43,77.32 v29.06,77.33
N$41
  Top 0.203: C9.1 'DUINO.P$6
N$42  (via drill 0.41)
  Top 0.305: POWER.2 29.53,24.19 v28.73,24.99 | v23.51,24.99 23.51,24.27 POWER.1
  Bottom 0.254: v23.51,24.99 23.51,26.4 21.34,28.57 21.34,35.56 20.57,36.32 20.57,41.76 JP1.P$2
  Bottom 0.305: v28.73,24.99 v23.51,24.99
N$44
  Top 0.305: L1.1 24.52,27.84 26.44,26.04 26.44,18.59 26.33,18.48 28,18.48 28.23,18.25 28.84,18.25 | 28.84,18.25 29.43,18.25 POWER.6 | POWER.5 28.74,18.35 28.84,18.25
N$45
  Top 0.305: POWER.7 POWER.8 30.06,15.28 34.78,15.28 35.93,14.13 35.93,10.13 37.14,8.92 D4.A
N$47  (via drill 0.41)
  Top 0.254: H8.P$3 26.16,36.07 28.7,36.07 29.34,35.43 29.72,35.43 29.97,35.18 30.23,35.18 30.73,34.67 30.73,33.66 32.13,32.26 v32.13,29.72
  Top 0.305: C7.+ 34.47,25.6 34.42,25.65 31.5,25.65 31.37,25.78 31.37,27.69 32.13,28.7 v32.13,29.72 | v29.21,28.19 29.37,28.35 VR2.1
  Bottom 0.305: v32.13,29.72 32.12,29.7 VR2.1 29.21,29.55 v29.21,28.19
N$50  (via drill 0.41)
  Top 0.203: 3.03,88.12 H6.3 3.46,87.82 5.68,87.82 5.79,87.94 5.79,93.08 5.64,93.23 v5.18,95.1
  Bottom 0.203: v5.18,95.1 7.89,95.75 J1-CLK-IN.3
N$51
  Top 0.305: C6.+ 34.36,32.01 32.09,34.28 5VSEL.P$3 30.38,35.94 30.23,35.94 29.21,36.96 29.21,46.23 30.63,47.64 VR1.3
N$52  (via drill 0.41)
  Top 0.305: L1.2 24.22,29.57 v27.65,26.99
  Bottom 0.305: v27.65,26.99 27.55,31.14 36.18,31.22 37.27,34.18 5VSEL.P$1
N$53
  Top 0.203: H6.2 8.76,90.78 8.76,100.13 15.39,106.76 15.39,108.01 | 15.39,108.01 J10-ROTATE.1 | R24.1 17.87,105.54 15.39,108.01
  Bottom 0.203: J10-ROTATE.1 15.04,109.04
N$54
  Top 0.203: H6.4 9.07,87.94 6.82,87.94 6.74,88.01 6.74,94.91 7.73,95.9 7.73,105.99 4.69,109.04 J11-RST-SLP.1
N$55
  Top 0.203: R11.1 6.3,11.91 6.3,14.55 IC2.4
N$56
  Top 0.203: IC1.2 4.67,54.79 4.67,55.8 4.47,56.01 3.86,56.01 3.45,55.6 3.45,55.4 2.85,55.4 2.23,56.01 2.23,60.07 0.57,61.73 0.57,63.4 1.37,64.2 1.37,68.81 1.69,69.13 R4.1
N$57  (via drill 0.38)
  Top 0.203: v10.16,64.14 10.16,67.39 8.74,67.39 7.11,69.01 R5.1 | v9.96,56.01 v9.96,60.48 | IC1.4 v6.1,56.21
  Bottom 0.203: v10.16,64.14 9.14,63.12 9.14,60.48 v9.96,60.48 | v9.96,56.01 9.75,56.21 v6.1,56.21
N$58  (via drill 0.38)
  Top 0.203: v3.05,57.23 3.25,57.43 3.25,63.93 3.45,64.14 R6.1 | v7.32,57.23 7.32,54.79 IC1.6
  Bottom 0.203: v7.32,57.23 v3.05,57.23
N$59
  Top 0.203: R7.1 8.13,60.48 IC1.8
N$60  (via drill 0.38)
  Top 0.203: v9.14,58.85 9.14,63.12 9.35,63.32 9.35,66.98 7.52,66.98 6.71,66.17 R8.1 | v6.91,58.85 6.71,59.05 6.71,60.27 IC1.10
  Bottom 0.203: v6.91,58.85 v9.14,58.85
N$61
  Top 0.203: R9.1 5.08,64.14 5.49,63.73 5.49,60.48 IC1.12
N$62
  Top 0.203: R10.1 4.67,11.91 5.08,12.32 5.08,14.55 IC2.2
N$63  (via drill 0.41)
  Top 0.203: H6.5 4.15,85.22 v4.15,83.59
  Bottom 0.203: v4.15,83.59 4.08,83.59 4.08,96.01 2.63,97.46 2.63,98.83 4.28,100.48 J11-RST-SLP.3
N$64  (via drill 0.38)
  Top 0.203: v31.7,72.87 32.11,72.47 32.11,71.65 U1.14 | v21.92,56.62 21.95,55.8 21.95,52.73 v21.97,52.58
  Bottom 0.203: v31.7,72.87 33.53,71.04 34.34,71.04 34.95,70.43 34.95,60.68 24.73,60.64 v21.92,56.62 | H7.P$3 21.97,50.29 v21.97,52.58
N$65  (via drill 0.38)
  Top 0.203: v31.5,70.23 31.5,71.45 U1.13
  Bottom 0.203: v31.5,70.23 31.5,65.96 28.45,65.96 27.84,65.35 27.84,63.32 31.09,63.32 31.7,62.71 31.7,61.7 21.13,61.7 21.13,55.8 30.07,55.8 31.29,57.02 31.7,57.02 32.31,56.41 32.31,54.66 30.28,54.66 27.43,51.94 H7.P$2
N$67  (via drill 0.41)
  Top 0.203: IC3.1 IC3.2 22.8,54.68 22.73,54.61 22.73,51.94 22.23,51.44 22.23,48.01 20.45,46.23 20.45,38.86 v21.46,37.85
  Bottom 0.203: v21.46,37.85 21.84,37.85 H8.P$5
N$68
  Top 0.203: R1.1 24.89,90.93 H9.P$1
N$70
  Top 0.203: IC3.3 25.35,54.68 25.35,56.52 29,56.52 TR24.2
N$71
  Top 0.203: TR24.1 29.73,54.27 R25.1
OUTLINE1  (via drill 0.38)
  Top 0.203: 3.45,53.77 3.45,49.91 H4.1 | 3.45,53.77 3.45,53.98 4.06,54.59 IC1.1 | 3.45,53.77 v2.23,54.99
  Bottom 0.203: v2.23,54.99 2.23,58.65 9.96,66.37 14.43,66.37 14.43,82.22 16.26,84.05 LED2.K
OUTLINE2  (via drill 0.38, 0.41)
  Top 0.203: IC1.3 5.49,54.59 5.45,54.55 v5.45,53.23 | v17.48,60.07 17.48,72.67 16.26,73.89 LED3.K | v11.18,57.63 10.77,57.23 v10.77,54.23 | H4.2 7.2,51.96 v7.2,52.88
  Bottom 0.203: v17.48,60.07 15.04,57.63 v11.18,57.63 | v5.45,53.23 6.93,54.48 7.2,54.48 | 7.2,54.48 10.44,54.48 10.77,54.5 v10.77,54.23 | v7.2,52.88 7.2,54.48
OUTLINE3  (via drill 0.38)
  Top 0.203: v6.1,58.04 6.5,57.63 6.5,56.82 6.91,56.41 6.91,55.8 6.71,55.6 6.71,54.79 IC1.5 6.71,54.59 6.78,54.51 6.78,53.76 5.79,52.27 5.79,48.46 5.11,47.66 4.15,47.66 3.86,47.37 H4.3
  Bottom 0.203: v6.1,58.04 3.25,58.04 3.25,59.05 10.16,65.96 14.22,65.96 16.26,63.93 LED4.K
OUTLINE4  (via drill 0.38, 0.41)
  Top 0.203: v7.92,58.04 7.92,58.85 7.52,59.26 7.52,60.27 IC1.9 | v6.71,47.36 6.96,47.35 H4.4
  Bottom 0.203: v7.92,58.04 9.14,56.82 13.21,56.82 16.26,53.77 LED5.K 17.56,52.39 17.56,45.64 17.6,45.61 17.6,42.33 17.56,42.29 15.16,42.29 14.55,42.9 14.55,46.14 7.92,46.14 v6.71,47.36
OUTLINE5  (via drill 0.38)
  Top 0.203: IC1.11 6.1,59.05 5.28,58.24 5.28,56.62 v5.08,56.41 | H4.5 3.53,44.96 5.71,44.96 5.7,47.5 v6.69,48.64
  Bottom 0.203: v5.08,56.41 5.04,55.17 10.39,55.17 11.79,56.41 12.19,56.41 15.04,53.57 15.04,46.66 | 15.04,46.66 16.26,45.3 LED6.K | v6.69,48.64 8.64,46.66 15.04,46.66
OUTLINE6  (via drill 0.38, 0.41)
  Top 0.203: v3.05,56.21 4.88,58.04 4.88,60.27 IC1.13 | v5.98,36.01 6.25,36.46 6.25,41.68 6.36,41.8 6.36,44.65 6.67,44.96 v6.86,44.96 8.15,44.96 8.28,44.83 H4.6 | v4.3,52.92 4.65,52.92 v4.65,51.32
  Bottom 0.203: v3.05,56.21 3.05,52.96 v4.3,52.92 | LED7.K 13.66,35.97 v5.98,36.01 | v4.65,51.32 4.65,44.96 v6.86,44.96
OUTLINE7  (via drill 0.41)
  Top 0.203: v4.04,13.11 4.04,14.24 IC2.1 4.4,15.11 3.77,15.73 3.77,26.33 0.57,29.53 0.57,33.45 0.76,33.64 0.76,38.71 1.1,38.9 2.42,38.9 H5.1
  Bottom 0.203: v4.04,13.11 4.92,10.17 6.4,9.03 9.68,9.11 | 8.99,9.11 9.68,9.11 | 9.68,9.11 17.41,9.11 17.83,9.53 17.83,21.3 16.26,22.87 LED8.K
OUTLINE8  (via drill 0.41)
  Top 0.203: v5.87,16.54 5.7,16.37 IC2.3 | v8.84,29.41 6.97,31.28 6.97,35.09 6.9,35.17 6.9,38.67 7.73,39.51 8.61,39.51 8.98,39.88 H5.2
  Bottom 0.203: LED9.K 16.02,13.3 8.57,13.3 5.87,16 v5.87,16.54 8.84,19.51 v8.84,29.41
PW|DIV32  (via drill 0.38)
  Top 0.203: U1.25 34.47,80.47 v34.47,81.31 | v33.76,103.35 BREAKOUT.11
  Bottom 0.203: v34.47,81.31 34.47,103.3 34.49,103.33 33.78,103.33 v33.76,103.35
RESET  (via drill 0.38)
  Top 0.203: R21.2 30.23,82.18 | 30.23,82.18 30.49,81.15 U1.29 | C9.2 37.31,71.11 | 37.31,71.11 v37.31,76.76 | v36.16,81.94 35.92,82.18 30.23,82.18 | 37.31,71.11 35.29,69.09 34.14,69.09 | 34.14,69.09 34.11,69.09 | ISP.5 33.12,69.01 34.14,69.01 34.14,69.09
  Bottom 0.203: v37.31,76.76 37.31,81.94 v36.16,81.94
SCK  (via drill 0.38)
  Top 0.203: v30.68,72.87 30.68,73.69 31.9,73.69 32.51,73.08 32.51,72.87 35.15,72.87 U1.17 | v30.89,62.51 30.68,62.71 30.68,64.54 32.51,66.37 32.92,66.37 ISP.3 33.12,66.37 33.93,66.37 35.36,64.95 35.36,53.52 34.8,52.83 31.62,52.83 29.21,50.67 29.21,47.24 28.45,46.48 28.45,45.85 H7.P$6
  Bottom 0.203: v30.68,72.87 30.68,66.37 28.25,66.37 27.43,65.56 27.43,62.51 v30.89,62.51
SHFL|RESET  (via drill 0.38)
  Top 0.203: U1.28 v31.29,81.43 | v32,94.61 34.14,95.63 36.58,95.63 | 36.58,95.63 36.65,95.63 | 36.58,95.63 36.58,95.83 BREAKOUT.5
  Bottom 0.203: v31.29,81.43 32.79,82.86 32.77,94.59 32.74,94.61 v32,94.61
SKIP|DIV16  (via drill 0.38)
  Top 0.203: U1.26 33.22,80.03 33.22,81.05 33.43,81.25 v33.43,81.33 | v33.53,100.89 33.63,100.99 35.76,100.99 35.76,100.91 36.37,100.91 BREAKOUT.9
  Bottom 0.203: v33.43,81.33 33.81,81.71 33.81,100.89 v33.53,100.89
SYNC|SPREAD  (via drill 0.38)
  Top 0.203: U1.27 32.41,80.01 v32.41,81.31 | v32.08,97.05 32.16,97.13 34.37,97.13 35.13,97.89 | 35.13,97.89 35.26,98.02 35.26,98.22 | BREAKOUT.7 36.37,98.27 35.15,98.27 35.15,97.87 35.13,97.89
  Bottom 0.203: v32.41,81.31 33.33,82.22 33.3,97.03 33.3,97.05 v32.08,97.05

### Text on the board
tPlace: BUSCLK | INT | EXT | -12V
bPlace: + | + | + | + | + | + | + | + | +
_tsilk: 4ms CLOCKER 1.2 | LED | 10k
_bsilk: White | Blue | Red (Blue) | Green | Red (Green) | Blue (Green) | Green | Blue (Green) | Red (Blue) | RCD (SCM)